# EAGLE design RN-XV_ZigBeeFootprint (EAGLE 7.2.0)
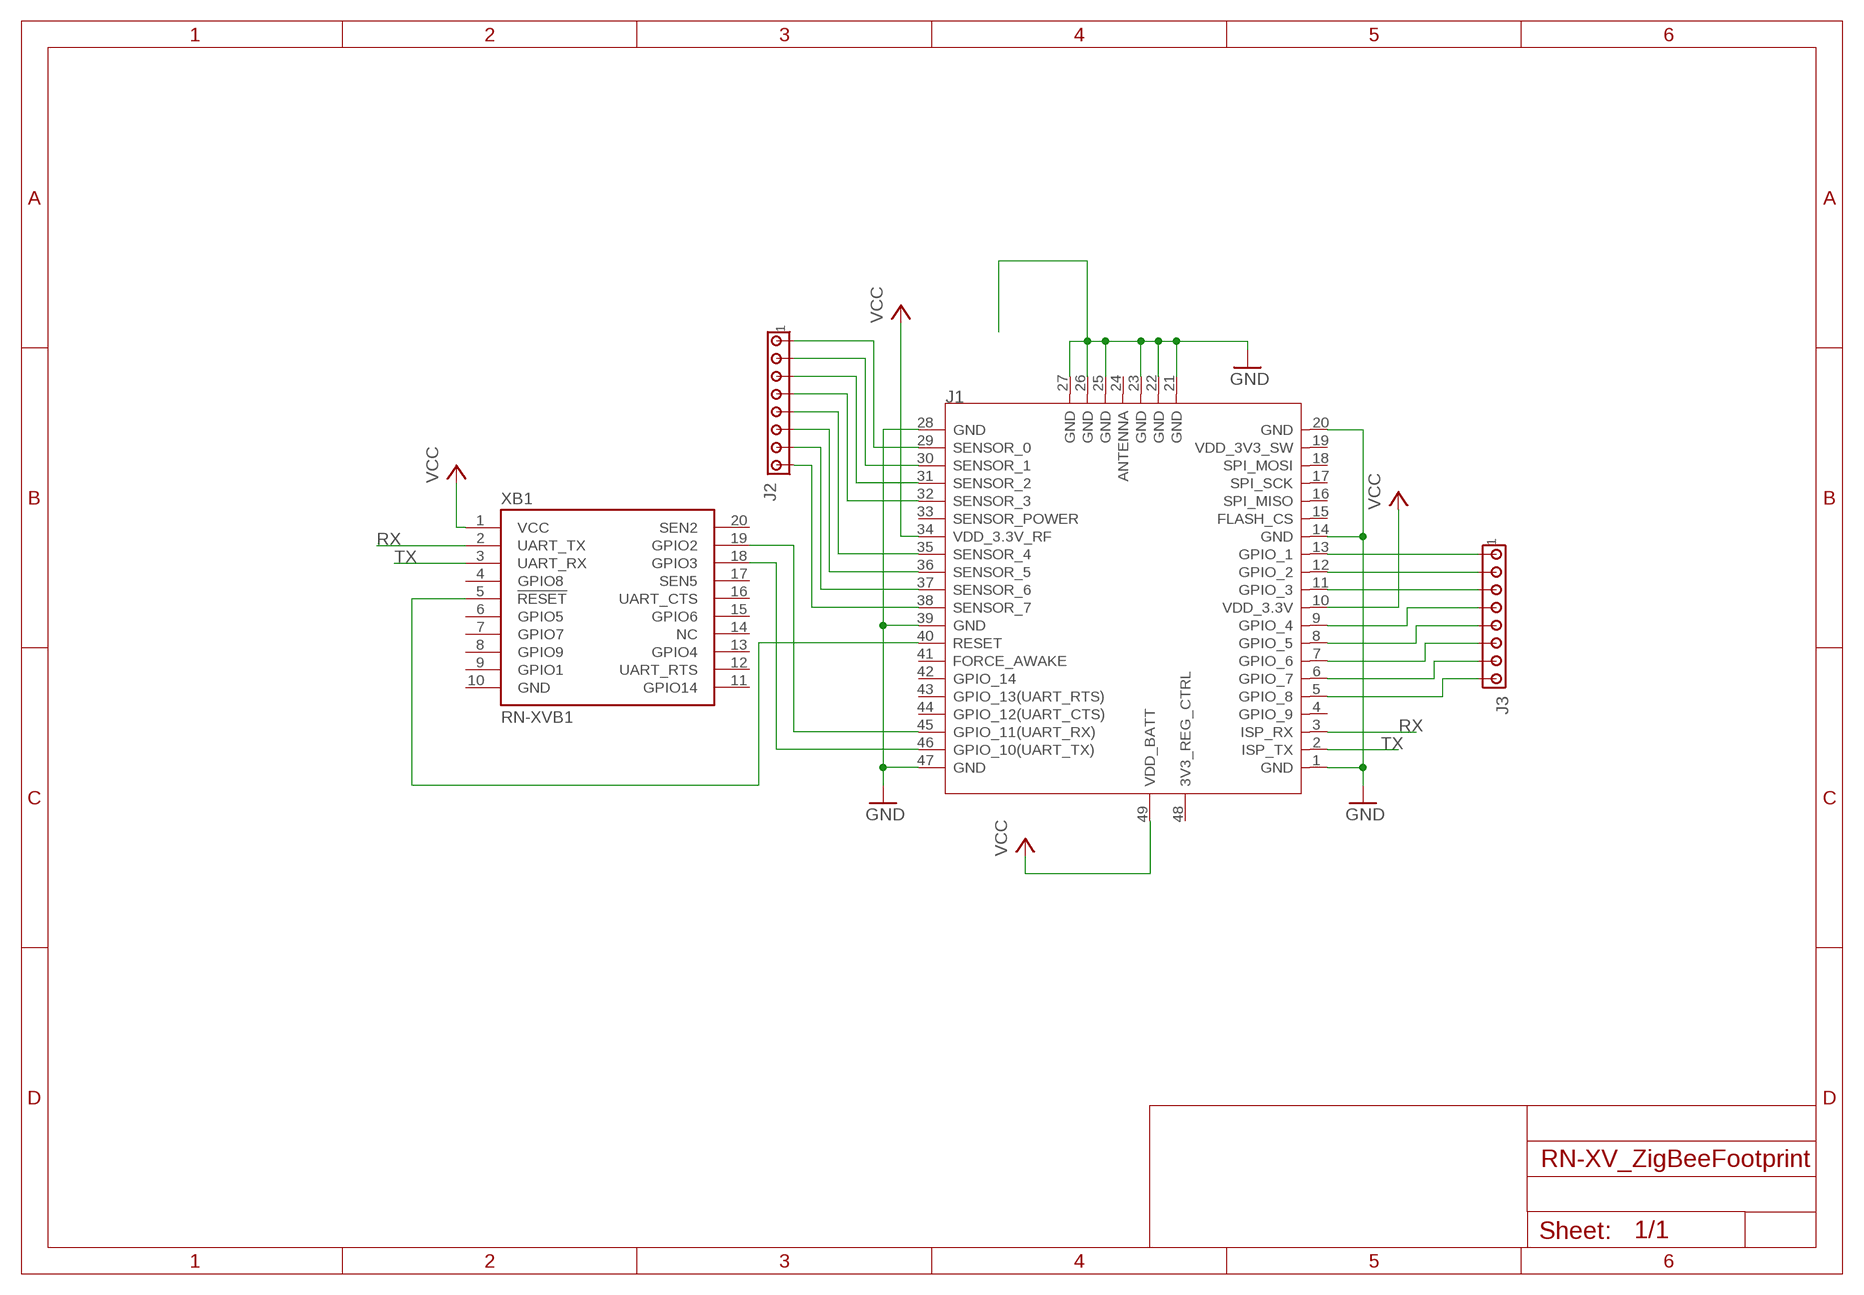
[diagram p0: schematic, sheet 1]

## Parts
J1  MODULE_WIFI-RN-171  [MODULE_49P-1.27-26.67X17.78]
J2  MTA08-100  [10X08MTA]
J3  MTA08-100  [10X08MTA]
XB1  RN-XVB1  [XBEE]

## Nets
GND: J1.1(GND) J1.14(GND) J1.20(GND) J1.21(GND) J1.22(GND) J1.23(GND) J1.25(GND) J1.26(GND) J1.27(GND) J1.28(GND) J1.39(GND) J1.47(GND)
N$1: J1.38(SENSOR_7) J2.8
N$2: J1.37(SENSOR_6) J2.7
N$3: J1.40(RESET) XB1.5(!RESET)
N$4: J1.46(GPIO_10(UART_TX)) XB1.18(GPIO3)
N$5: J1.45(GPIO_11(UART_RX)) XB1.19(GPIO2)
N$6: J1.36(SENSOR_5) J2.6
N$7: J1.35(SENSOR_4) J2.5
N$8: J1.32(SENSOR_3) J2.4
N$9: J1.30(SENSOR_1) J2.2
N$10: J1.29(SENSOR_0) J2.1
N$11: J1.31(SENSOR_2) J2.3
N$12: J1.13(GPIO_1) J3.1
N$13: J1.12(GPIO_2) J3.2
N$14: J1.11(GPIO_3) J3.3
N$15: J1.9(GPIO_4) J3.4
N$16: J1.8(GPIO_5) J3.5
N$17: J1.7(GPIO_6) J3.6
N$18: J1.6(GPIO_7) J3.7
N$19: J1.5(GPIO_8) J3.8
RX: J1.3(ISP_RX) XB1.2(UART_TX)
TX: J1.2(ISP_TX) XB1.3(UART_RX)
VDD_3.3V: J1.10(VDD_3.3V) J1.34(VDD_3.3V_RF) J1.49(VDD_BATT) XB1.1(VCC) ; supply symbol labelled VCC
Unconnected: J1.4(GPIO_9) J1.15(FLASH_CS) J1.16(SPI_MISO) J1.17(SPI_SCK) J1.18(SPI_MOSI) J1.19(VDD_3V3_SW) J1.24(ANTENNA) J1.33(SENSOR_POWER) J1.41(FORCE_AWAKE) J1.42(GPIO_14) J1.43(GPIO_13(UART_RTS)) J1.44(GPIO_12(UART_CTS)) J1.48(3V3_REG_CTRL) XB1.4(GPIO8) XB1.6(GPIO5) XB1.7(GPIO7) XB1.8(GPIO9) XB1.9(GPIO1) XB1.11(GPIO14) XB1.12(UART_RTS) XB1.13(GPIO4) XB1.14(NC) XB1.15(GPIO6) XB1.16(UART_CTS) XB1.17(SEN5) XB1.20(SEN2)

## Power pins joined to a net without a drawn wire
GND: XB1.10(GND)

## Library data of the parts
J1 = rn171:MODULE_WIFI-RN-171: WIFLY GSX 802.11 b/g wireless LAN Module
J2 J3 = con-amp:MTA08-100: AMP connector
XB1 = SteveMarple:RN-XV

## Board
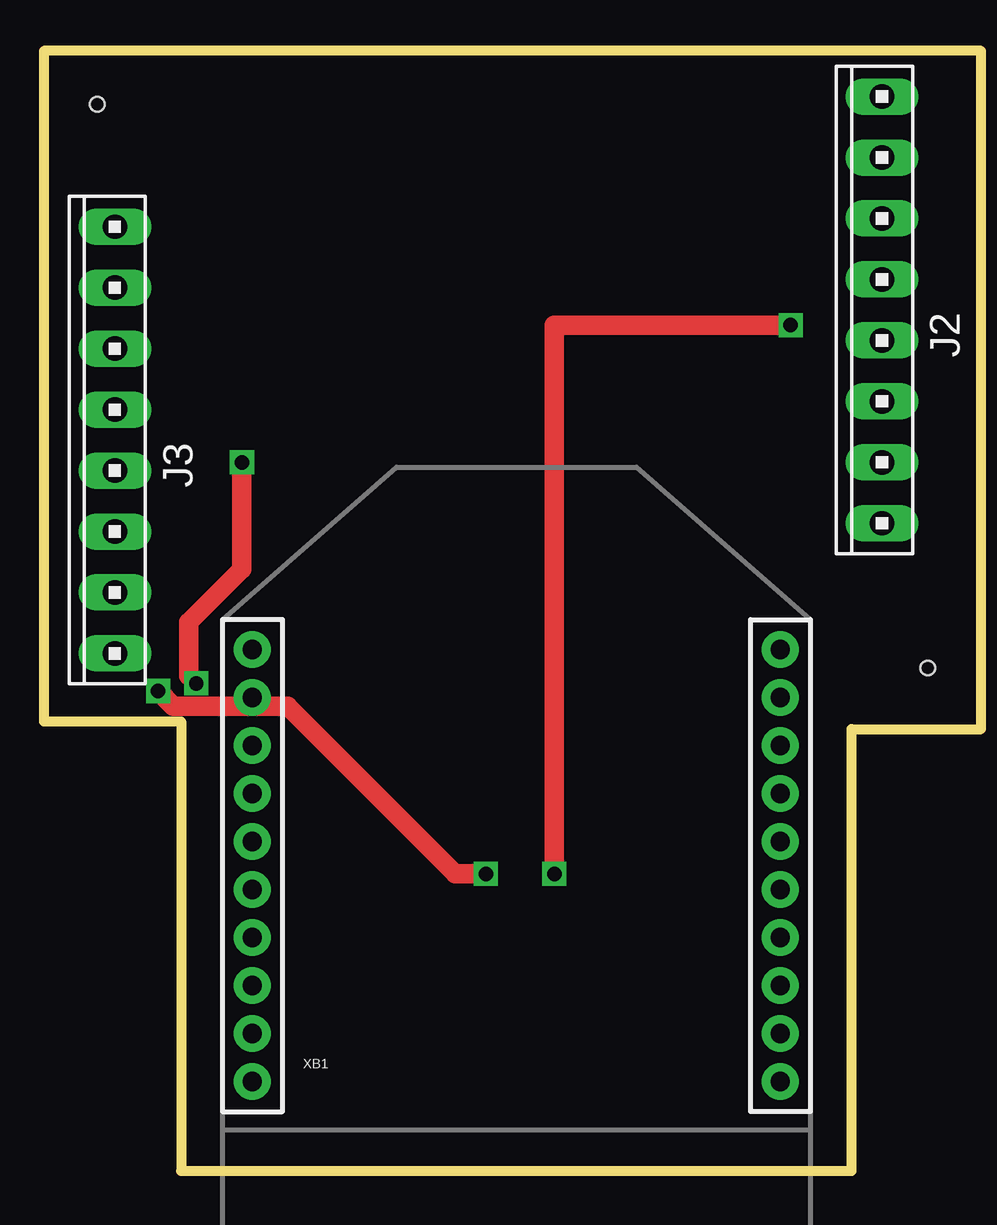
[diagram p1: board, top side]
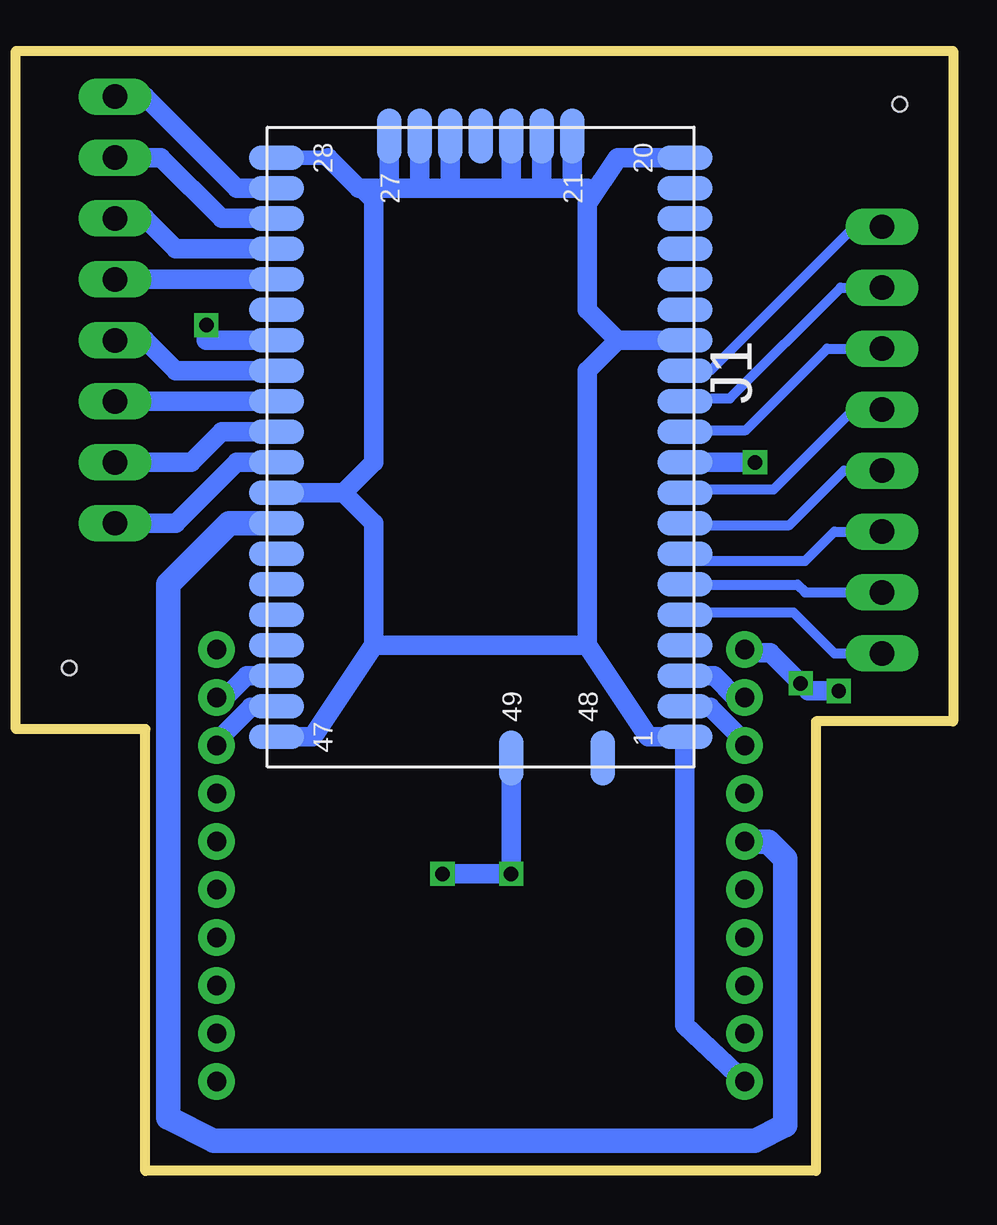
[diagram p2: board, bottom side, seen from below]

No outline drawn. Coordinates in mm, seen from the top.
Copper layers (1*16): Top 0.035mm / dielectric 1.5mm / Bottom 0.035mm
Design rules "default": minimum track width 10mil, minimum drill 24mil, track to track 8mil, track to pad 8mil, pad to pad 8mil, via to via 8mil, smd to smd 8mil, copper to edge 40mil, drill to drill 8mil, minimum pad ring 10mil, minimum via ring 8mil, stop-mask expansion 4mil, vias tented up to drill 0mil, thermal gap 10mil
Holes 0.6 mm at -3.49,44.45 31.11,20.95
Milling: 8 lines

### Footprints (pad centres in the part's own frame; a part is rotated, then mirrored left to right if it is on the bottom)
MODULE_49P-1.27-26.67X17.78 = smd 1.016 x 2.286: 1 12.065,8.509; 2 10.795,8.509; 3 9.525,8.509; 4 8.255,8.509; 5 6.985,8.509; 6 5.715,8.509; 7 4.445,8.509; 8 3.175,8.509; 9 1.905,8.509; 10 0.635,8.509; 11 -0.635,8.509; 12 -1.905,8.509; 13 -3.175,8.509; 14 -4.445,8.509; 15 -5.715,8.509; 16 -6.985,8.509; 17 -8.255,8.509; 18 -9.525,8.509; 19 -10.795,8.509; 20 -12.065,8.509; 28 -12.065,-8.509; 29 -10.795,-8.509; 30 -9.525,-8.509; 31 -8.255,-8.509; 32 -6.985,-8.509; 33 -5.715,-8.509; 34 -4.445,-8.509; 35 -3.175,-8.509; 36 -1.905,-8.509; 37 -0.635,-8.509; 38 0.635,-8.509; 39 1.905,-8.509; 40 3.175,-8.509; 41 4.445,-8.509; 42 5.715,-8.509; 43 6.985,-8.509; 44 8.255,-8.509; 45 9.525,-8.509; 46 10.795,-8.509; 47 12.065,-8.509 | smd 2.286 x 1.016: 21 -12.954,3.81; 22 -12.954,2.54; 23 -12.954,1.27; 24 -12.954,0; 25 -12.954,-1.27; 26 -12.954,-2.54; 27 -12.954,-3.81; 48 12.954,5.08; 49 12.954,1.27
10X08MTA = drill 1.016 long: 1 8.89,0; 2 6.35,0; 3 3.81,0; 4 1.27,0; 5 -1.27,0; 6 -3.81,0; 7 -6.35,0; 8 -8.89,0
XBEE = drill 0.8 pad 1.524: 1 -11,20; 2 -11,18; 3 -11,16; 4 -11,14; 5 -11,12; 6 -11,10; 7 -11,8; 8 -11,6; 9 -11,4; 10 -11,2; 11 11,2; 12 11,4; 13 11,6; 14 11,8; 15 11,10; 16 11,12; 17 11,14; 18 11,16; 19 11,18; 20 11,20

### Placement (x,y rotation side)
J1  13.97,30.16 270 bottom
J2  29.21,35.88 90 top
J3  -2.76,30.45 90 top
XB1  13.97,1.73 0 top

### Tracks (layer width: path | path; a pad name or v marks a point on that pad's centre or on a via)
GND
  Bottom 0.61: 9.53,40.32 9.53,40.96 | 19.05,40.96 18.41,40.32 | J1.28 20.32,42.23
  Bottom 0.813: J1.20 8.26,42.23 9.53,40.32 9.53,35.88 8.26,34.61 | 8.26,34.61 J1.14 | 9.53,40.96 10.16,40.96 | 10.16,40.96 11.43,40.96 | 11.43,40.96 12.7,40.96 | 12.7,40.96 15.24,40.96 | 15.24,40.96 16.51,40.96 | 16.51,40.96 17.78,40.96 | 17.78,40.96 19.05,40.96 20.32,42.23 | 18.41,40.32 18.41,29.53 19.68,28.26 | J1.39 19.68,28.26 | 19.68,28.26 18.41,26.99 18.41,21.91 | 18.41,21.91 20.95,18.1 J1.47 | J1.21 10.16,40.96 | J1.22 11.43,40.96 | J1.23 12.7,40.96 | J1.25 15.24,40.96 | J1.26 16.51,40.96 | J1.27 17.78,40.96 | 18.41,21.91 9.53,21.91 | 9.53,21.91 6.99,18.1 J1.1 5.46,6.08 XB1.10 | 8.26,34.61 9.53,33.34 9.53,21.91
N$1
  Bottom 0.813: J1.38 24.13,29.53 26.67,26.99 J2.8
N$2
  Bottom 0.813: J1.37 24.77,30.8 26.04,29.53 J2.7
N$3
  Bottom 1.016: XB1.5 1.98,13.73 1.27,13.02 1.27,1.91 2.54,1.27 25.08,1.27 26.99,2.22 26.99,24.45 24.45,26.99 J1.40
N$4
  Bottom 0.813: J1.46 22.53,19.32 23.56,19.32 24.97,17.91 XB1.18
N$5
  Bottom 0.813: J1.45 23.72,20.64 24.63,19.73 XB1.19
N$6
  Bottom 0.813: J1.36 J2.6
N$7
  Bottom 0.813: J1.35 26.67,33.34 27.94,34.61 J2.5
N$8
  Bottom 0.813: J1.32 J2.4
N$9
  Bottom 0.813: J1.30 24.77,39.69 27.3,42.23 J2.2
N$10
  Bottom 0.813: J1.29 24.13,40.96 27.94,44.77 J2.1
N$11
  Bottom 0.813: J1.31 26.67,38.42 27.94,39.69 J2.3
N$12
  Bottom 0.406: J1.13 5.45,33.35 4.41,33.35 -1.59,39.34 J3.1
N$13
  Bottom 0.406: J1.12 5.33,32.19 3.58,32.19 -1.03,36.8 J3.2
N$14
  Bottom 0.406: J1.11 5.38,30.87 2.92,30.87 -0.47,34.27 J3.3
N$15
  Bottom 0.406: J1.9 5.32,28.4 1.76,28.4 -1.56,31.73 J3.4
N$16
  Bottom 0.406: J1.8 5.38,26.91 1.1,26.91 -1.17,29.18 J3.5
N$17
  Bottom 0.406: J1.7 5.17,25.43 0.45,25.43 -0.78,26.64 J3.6
N$18
  Bottom 0.406: J1.6 5.45,24.43 0.78,24.43 0.45,24.11 J3.7
N$19
  Bottom 0.406: J1.5 5.36,23.28 0.94,23.28 -0.78,21.57 J3.8
RX
  Bottom 0.813: J1.3 4.24,20.64 3.33,19.73 XB1.2
TX
  Bottom 0.813: J1.2 5.41,19.32 4.41,19.32 2.97,17.88 XB1.3
VDD_3.3V  (via drill 0.6)
  Top 0.813: v2.54,29.53 2.54,25.08 0.32,22.86 0.32,20.64 v0.64,20.32 | v12.7,12.38 11.43,12.38 4.45,19.37 -0.32,19.37 v-0.95,20 | v25.4,35.24 15.56,35.24 v15.56,12.38
  Bottom 0.813: J1.10 v2.54,29.53 | XB1.1 2.83,21.59 1.91,21.59 v0.64,20.32 0.32,20 v-0.95,20 | J1.49 v12.7,12.38 v15.56,12.38 | J1.34 25.4,34.61 v25.4,35.24

### Text on the board
Document: REV 1.0